# Altium schematic sheet mechanical.SchDoc: Mechanical
size A4; Organization: Altium Limited; Address1: L3, 12a Rodborough Rd; Address2: Frenchs Forest; Address3: NSW; Address4: Australia 2086
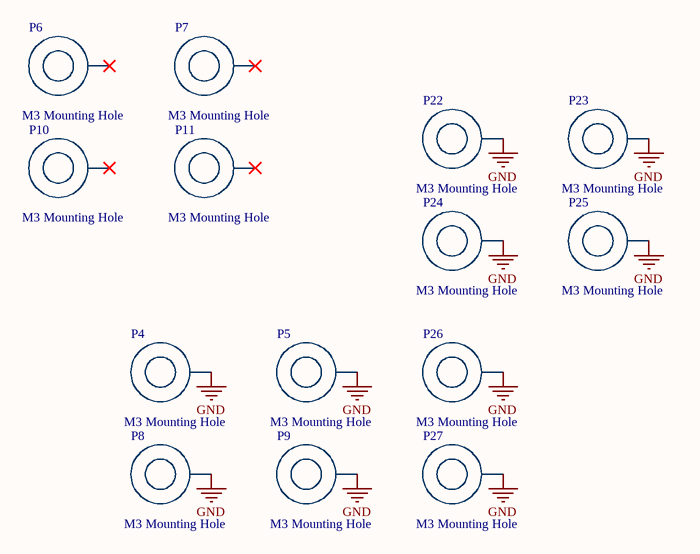
[diagram p0: mechanical.SchDoc]

## Parts
P4  M3 Mounting Hole  [MH-M3]
P5  M3 Mounting Hole  [MH-M3]
P6  M3 Mounting Hole  [MH-M3]
P7  M3 Mounting Hole  [MH-M3]
P8  M3 Mounting Hole  [MH-M3]
P9  M3 Mounting Hole  [MH-M3]
P10  M3 Mounting Hole  [MH-M3]
P11  M3 Mounting Hole  [MH-M3]
P22  M3 Mounting Hole  [MH-M3]
P23  M3 Mounting Hole  [MH-M3]
P24  M3 Mounting Hole  [MH-M3]
P25  M3 Mounting Hole  [MH-M3]
P26  M3 Mounting Hole  [MH-M3]
P27  M3 Mounting Hole  [MH-M3]

## Nets
GND: P4.1 P5.1 P8.1 P9.1 P22.1 P23.1 P24.1 P25.1 P26.1 P27.1

Not connected (* = marked no-connect by the designer): P6 1*; P7 1*; P10 1*; P11 1*

## Notes on the sheet
- Title
- Date:
- RE:
- Arturo di Girolamo
- Size:
- A3
- A

## Library data of the parts
P4-P11 P22-P27 = MH-M3